# Altium project motor_control.PrjPcb
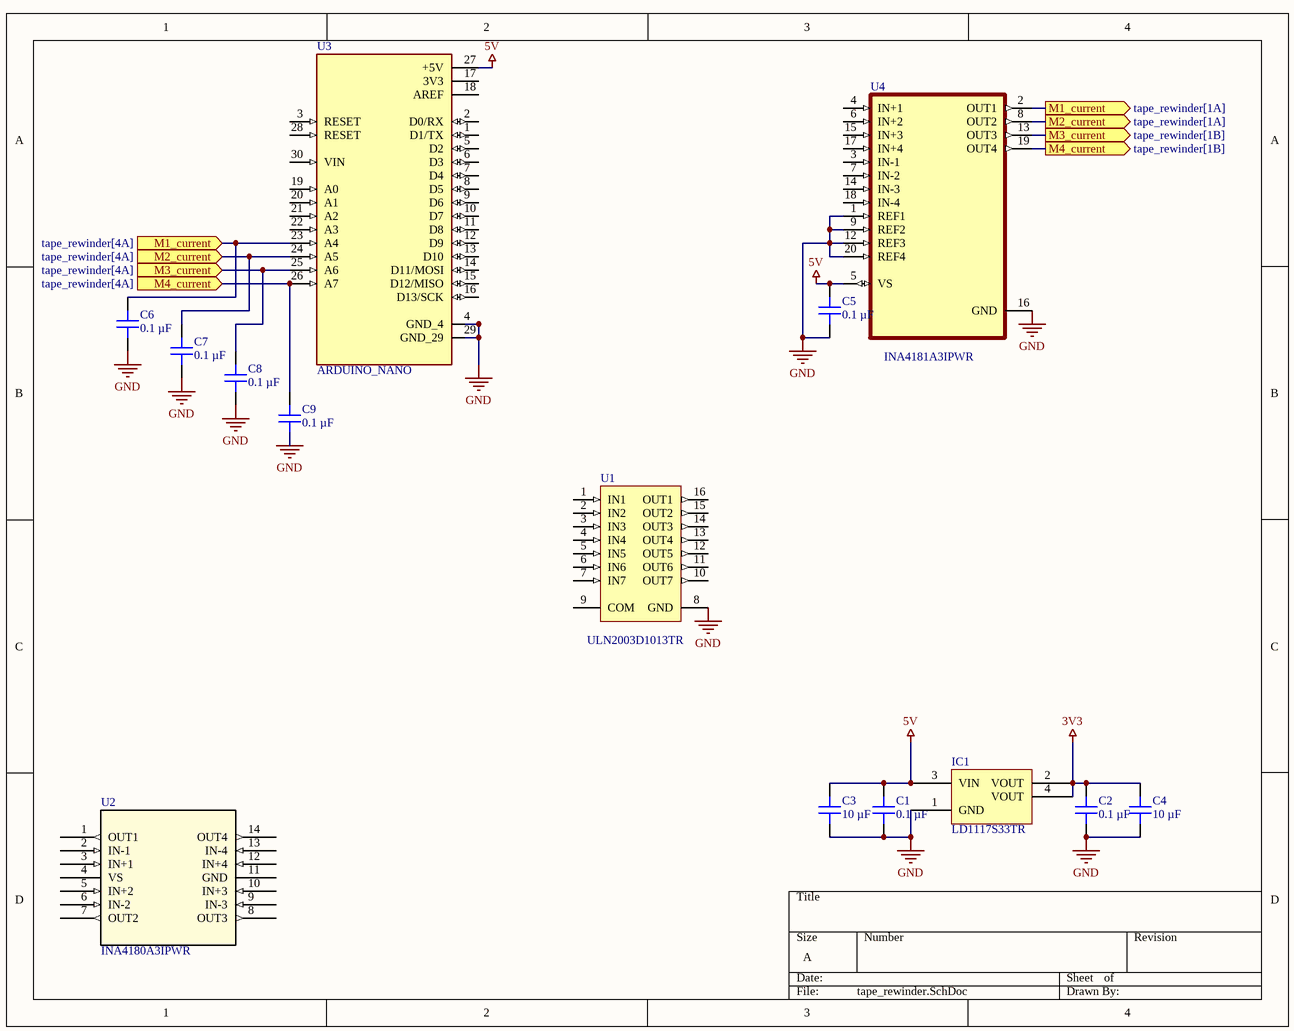
[diagram p0: tape_rewinder.SchDoc]
1 sheet, 14 parts. Net scope: flat (ports and power ports of the same name join across sheets).
Board file: PCB1.PcbDoc

## Sheet tape_rewinder.SchDoc
size A; SheetNumber: 1; SheetTotal: 1

### Parts
C1  0.1 µF  [CAP 0805_2012]
C2  0.1 µF  [CAP 0805_2012]
C3  10 µF  [CAP 0805_2012]
C4  10 µF  [CAP 0805_2012]
C5  0.1 µF  [CAP 0805_2012]
C6  0.1 µF  [CAP 0805_2012]
C7  0.1 µF  [CAP 0805_2012]
C8  0.1 µF  [CAP 0805_2012]
C9  0.1 µF  [CAP 0805_2012]
IC1  LD1117S33TR  [ST SOT-223]
U1  ULN2003D1013TR  [STM-SO-16_M]
U2  INA4180A3IPWR  [*SOP65P640X120-14N]
U3  ARDUINO_NANO  [MODULE_ARDUINO_NANO]
U4  INA4181A3IPWR  [SOP65P640X120-20N]

### Ports
M1_current (in, see tape_rewinder[4A]), M1_current (out, see tape_rewinder[1A]), M2_current (in, see tape_rewinder[4A]), M2_current (out, see tape_rewinder[1A]), M3_current (in, see tape_rewinder[4A]), M3_current (out, see tape_rewinder[1B]), M4_current (in, see tape_rewinder[4A]), M4_current (out, see tape_rewinder[1B])

### Nets
3V3: C2.2 C4.2 IC1.2(VOUT) IC1.4(VOUT)
5V: C1.2 C3.2 C5.2 IC1.3(VIN) U3.27(+5V) U4.5(VS)
GND: C1.1 C2.1 C3.1 C4.1 C5.1 C6.1 C7.1 C8.1 C9.1 IC1.1(GND) U1.8(GND) U3.4(GND_4) U3.29(GND_29) U4.1(REF1) U4.9(REF2) U4.12(REF3) U4.16(GND) U4.20(REF4)
NetC6_2: C6.2 U3.23(A4) U4.2(OUT1) ; port M1_current
NetC7_2: C7.2 U3.24(A5) U4.8(OUT2) ; port M2_current
NetC8_2: C8.2 U3.25(A6) U4.13(OUT3) ; port M3_current
NetC9_2: C9.2 U3.26(A7) U4.19(OUT4) ; port M4_current

Not connected (* = marked no-connect by the designer): U1 1(IN1) 2(IN2) 3(IN3) 4(IN4) 5(IN5) 6(IN6) 7(IN7) 9(COM) 10(OUT7) 11(OUT6) 12(OUT5) 13(OUT4) 14(OUT3) 15(OUT2) 16(OUT1); U2 1(OUT1) 2(IN-1) 3(IN+1) 4(VS) 5(IN+2) 6(IN-2) 7(OUT2) 8(OUT3) 9(IN-3) 10(IN+3) 11(GND) 12(IN+4) 13(IN-4) 14(OUT4); U3 1(D1/TX) 2(D0/RX) 3(RESET) 5(D2) 6(D3) 7(D4) 8(D5) 9(D6) 10(D7) 11(D8) 12(D9) 13(D10) 14(D11/MOSI) 15(D12/MISO) 16(D13/SCK) 17(3V3) 18(AREF) 19(A0) 20(A1) 21(A2) 22(A3) 28(RESET) 30(VIN); U4 3(IN-1) 4(IN+1) 6(IN+2) 7(IN-2) 14(IN-3) 15(IN+3) 17(IN+4) 18(IN-4)

### Library data of the parts
C1 C2 C5-C9 = CC0805MRX7R9BB104: CAP CER 0.1UF 50V X7R 0805; manufacturer: Yageo; Tolerance: ±20%; Part Number: CC0805MRX7R9BB104; Capacitance: 0.1 µF; Applications: General Purpose; componentlink1description: Datasheet; componentlink1url: https://www.yageo.com/upload/media/product/productsearch/datasheet/mlcc/UPY-GPHC_X7R_6.3V-to-50V_18.pdf; componentlink2description: DigiKey Link; componentlink2url: https://www.digikey.com/en/products/detail/yageo/CC0805MRX7R9BB104/5884281; Device Package: 0805 (2012 Metric); lastupdated: 2/9/2024 8:16:09 PM; Lifecycle Status: Active; Minimum Order: 1; Mounting Type: Surface Mount, MLCC; Operating Temperature: -55°C ~ 125°C; Package / Case: 0805 (2012 Metric); packaging: TapeAndReel; partid: 2475; Part Status: Active; price: 0.01; series: CC; Size / Dimension: 0.079" L x 0.049" W (2.00mm x 1.25mm); Supplier 1: DigiKey; Supplier Part Number 1: 311-4351-1-ND; Temperature Coefficient: X7R; Thickness (Max): 0.037" (0.95mm); value: 0.1 µF; Voltage - Rated: 50V
C3 C4 = CC0805MKX7R7BB106: CAP CER 10UF 16V X7R 0805; manufacturer: Yageo; Tolerance: ±20%; Part Number: CC0805MKX7R7BB106; Capacitance: 10 µF; Applications: General Purpose; componentlink1description: Datasheet; componentlink1url: https://www.yageo.com/upload/media/product/productsearch/datasheet/mlcc/UPY-GPHC_X7R_6.3V-to-50V_18.pdf; componentlink2description: DigiKey Link; componentlink2url: https://www.digikey.com/en/products/detail/yageo/CC0805MKX7R7BB106/7164392; Device Package: 0805 (2012 Metric); lastupdated: 2/9/2024 8:15:14 PM; Lifecycle Status: Active; Minimum Order: 1; Mounting Type: Surface Mount, MLCC; Operating Temperature: -55°C ~ 125°C; Package / Case: 0805 (2012 Metric); packaging: TapeAndReel; partid: 27750; Part Status: Active; price: 0.13; series: CC; Size / Dimension: 0.079" L x 0.049" W (2.00mm x 1.25mm); Supplier 1: DigiKey; Supplier Part Number 1: 311-3508-1-ND; Temperature Coefficient: X7R; Thickness (Max): 0.057" (1.45mm); value: 10 µF; Voltage - Rated: 16V
IC1 = LD1117S33TR: IC REG LINEAR 3.3V 800MA SOT223; Manufacturer: STMicroelectronics; Current - Quiescent (Iq): 10 mA; Number of Regulators: 1; Output Configuration: Positive; Output Type: Fixed; Protection Features: Over Current, Over Temperature; PSRR: 75dB (120Hz); Voltage Dropout (Max): 1.2V @ 800mA; Voltage - Input (Max): 15V; Part Number: LD1117S33TR; ComponentLink1Description: Datasheet; ComponentLink1URL: http://www.st.com/content/ccc/resource/technical/document/datasheet/99/3b/7d/91/91/51/4b/be/CD00000544.pdf/files/CD00000544.pdf/jcr:content/translations/en.CD00000544.pdf; ComponentLink2Description: DigiKey Link; ComponentLink2URL: https://www.digikey.com/en/products/detail/stmicroelectronics/LD1117S33TR/585766; Current - Output: 800mA; LastUpdated: 6/3/2024 8:14:20 PM; Lifecycle Status: Active; Minimum Order: 1; Mounting Type: Surface Mount; Operating Temperature: 0°C ~ 125°C; Package / Case: TO-261-4, TO-261AA; Packaging: TapeAndReel; Part Status: Active; Price: 0.13; Series: -; Supplier 1: DigiKey; Supplier Part Number 1: 497-1242-1-ND; Supplier Device Package: SOT-223; Voltage - Output (Min/Fixed): 3.3V
U1 = CMP-2000-05374-1: Seven NPN Darlington Array Transistor, 50 V, 500 mA, -40 to 85 degC, 8-Pin SOIC, RoHS, Tape and Reel; Manufacturer: STMicroelectronics; Collector Emitter Voltage V(br)ceo: 50V; SVHC: NoSVHC(17-Dec-2015); DC Current Gain hFE: 1000hFE; DC Collector Current: 500mA; No. of Pins: 16Pins; Package Reference: SO-16; Transistor Polarity: NPN; Transistor Case Style: SOIC; Datasheet URL: https://datasheet.ciiva.com/1193/1690348-1193460.pdf; Package Description: 16-Pin Small Outline Integrated Circuit, Body 9.9 x 3.9 mm, Pitch 1.27 mm; Datasheet Version: Rev. 8, 06/2012; Power Dissipation Pd: -; Product Range: -; Operating Temperature Max: 85degC; MSL: MSL1-Unlimited; Manufacturer URL: http://www.st.com/; Automotive Qualification Standard: -
U2 = INA4180A3IPWR: 26V, quad channel, 350kHz current sense amplifier 14-TSSOP -40 to 125; Manufacturer_Name: Texas Instruments; Copyright: Copyright (C) 2025 Ultra Librarian. All rights reserved.; Manufacturer_Part_Number: INA4180A3IPWR; Datasheet: https://www.ti.com/lit/gpn/ina4180; RefDes: RefDes; Type: Type
U3 = ARDUINO_NANO: Small, complete, and breadboard-friendly board based on the ATmega328 (Arduino Nano 3.x); SnapEDA_Link: https://www.snapeda.com/parts/Arduino%20Nano/Arduino/view-part/?ref=snap; Package: Non-Standard Arduino; Value: *; MF: Arduino; MP: Arduino Nano; Check_prices: https://www.snapeda.com/parts/Arduino%20Nano/Arduino/view-part/?ref=eda
U4 = INA4181A3IPWR: Package: None; Price: None; Value: *; MP: INA4181A3IPWR; Availability: Unavailable